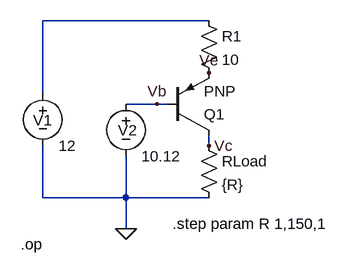
[diagram p0: schematic pnp-current-source1.asc]
pnp-current-source1.asc, the LTspice schematic file:
Version 4
SHEET 1 880 680
WIRE 272 16 16 16
WIRE 16 128 16 16
WIRE 192 144 144 144
WIRE 208 144 192 144
WIRE 272 208 272 192
WIRE 16 288 16 208
WIRE 144 288 144 224
WIRE 144 288 16 288
WIRE 272 288 144 288
WIRE 144 336 144 288
FLAG 144 336 0
FLAG 272 96 Ve
FLAG 192 144 Vb
FLAG 272 208 Vc
SYMBOL voltage 16 112 R0
WINDOW 0 -15 57 Left 2
SYMATTR InstName V1
SYMATTR Value 12
SYMBOL voltage 144 128 R0
WINDOW 0 -12 56 Left 2
WINDOW 123 0 0 Left 2
WINDOW 39 0 0 Left 2
SYMATTR InstName V2
SYMATTR Value 10.12
SYMBOL res 256 0 R0
SYMATTR InstName R1
SYMATTR Value 10
SYMBOL pnp 208 192 M180
SYMATTR InstName Q1
SYMBOL res 256 192 R0
SYMATTR InstName RLoad
SYMATTR Value {R}
TEXT -18 360 Left 2 !.op
TEXT 216 328 Left 2 !.step param R 1,150,1

The netlist it stands for:
* pnp-current-source1.asc
V1 N001 0 12
V2 Vb 0 10.12
R1 N001 Ve 10
Q1 Vc Vb Ve 0 PNP
RLoad Vc 0 {R}
.model NPN NPN
.model PNP PNP
.lib standard.bjt
.op
.step param R 1,150,1
.backanno
.end